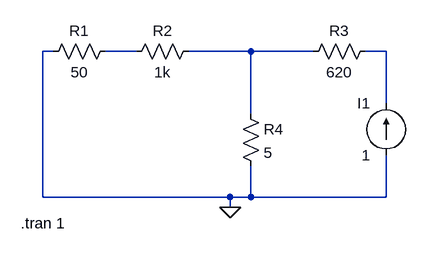
[diagram p0: schematic entrada.asc]
entrada.asc, the LTspice schematic file:
Version 4
SHEET 1 880 680
WIRE 16 96 0 96
WIRE 144 96 96 96
WIRE 320 96 224 96
WIRE 416 96 320 96
WIRE 528 96 496 96
WIRE 528 176 528 96
WIRE 320 192 320 96
WIRE 0 320 0 96
WIRE 288 320 0 320
WIRE 320 320 320 272
WIRE 320 320 288 320
WIRE 528 320 528 256
WIRE 528 320 320 320
WIRE 288 336 288 320
FLAG 288 336 0
SYMBOL res 112 80 R90
WINDOW 0 0 56 VBottom 2
WINDOW 3 32 56 VTop 2
SYMATTR InstName R1
SYMATTR Value 50
SYMBOL res 240 80 R90
WINDOW 0 0 56 VBottom 2
WINDOW 3 32 56 VTop 2
SYMATTR InstName R2
SYMATTR Value 1k
SYMBOL res 512 80 R90
WINDOW 0 0 56 VBottom 2
WINDOW 3 32 56 VTop 2
SYMATTR InstName R3
SYMATTR Value 620
SYMBOL res 304 176 R0
SYMATTR InstName R4
SYMATTR Value 5
SYMBOL current 528 256 R180
WINDOW 0 24 80 Left 2
WINDOW 3 24 0 Left 2
SYMATTR InstName I1
SYMATTR Value 1
TEXT -34 360 Left 2 !.tran 1

The netlist it stands for:
* entrada.asc
R1 N001 0 50
R2 N002 N001 1k
R3 N003 N002 620
R4 N002 0 5
I1 0 N003 1
.tran 1
.backanno
.end